# Altium schematic sheet 07 Motion.SchDoc
size A
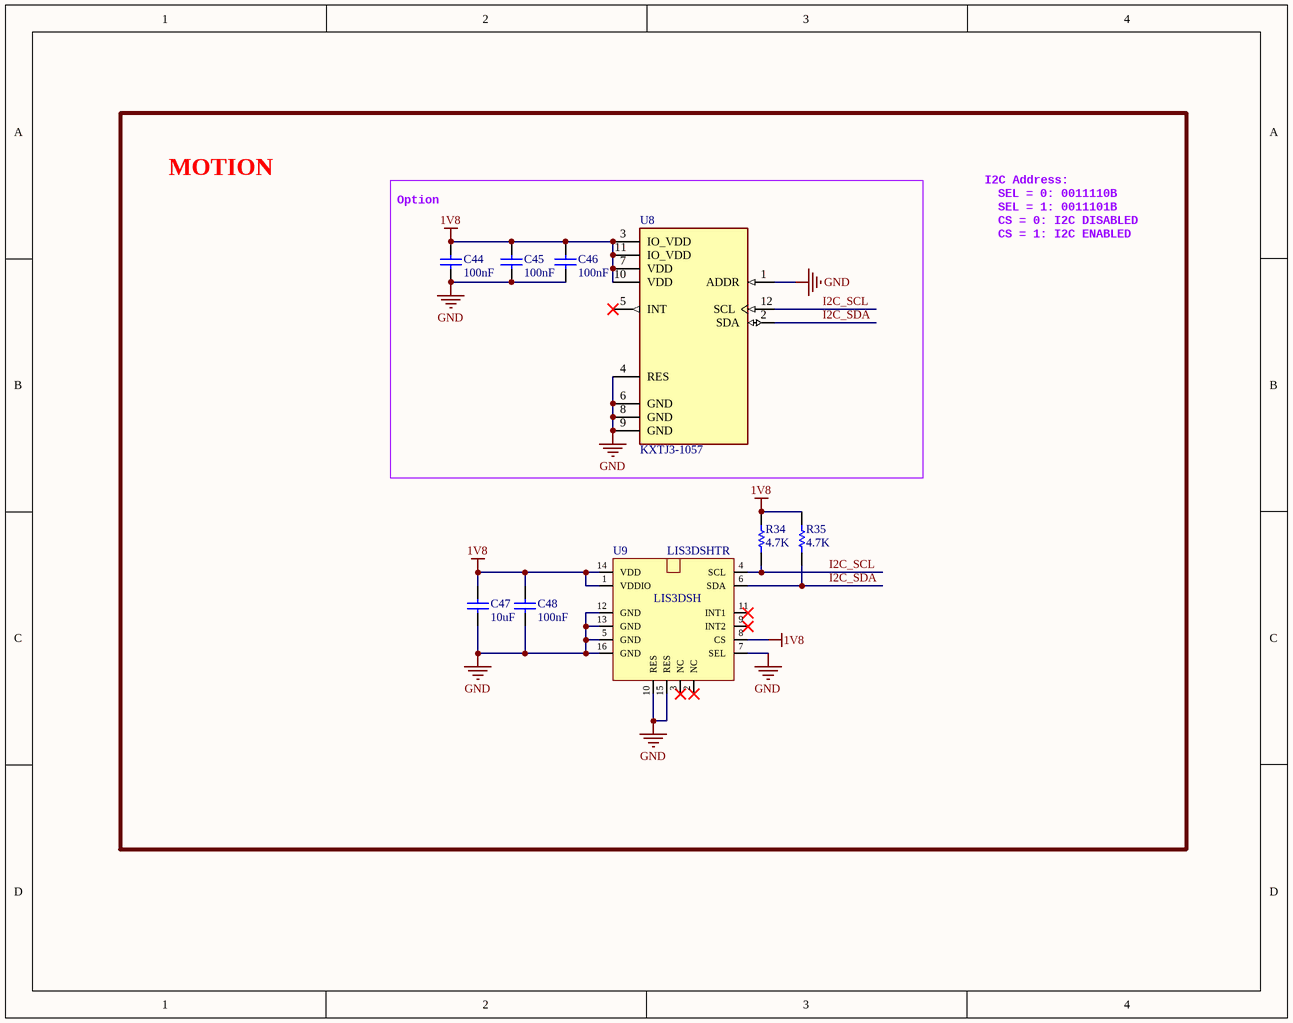
[diagram p0: 07 Motion.SchDoc]

## Parts
C44  100nF  [0603 - C]
C45  100nF  [0603 - C]
C46  100nF  [0603 - C]
C47  10uF  [0603 - C]
C48  100nF  [0603 - C]
R34  4.7K  [0603 - R]
R35  4.7K  [0603 - R]
U8  KXTJ3-1057  [KIONIX_KXTJ3-1057]
U9  LIS3DSHTR  [QFN16P 3x3 - 1]

## Blocks framed on the sheet
MOTION: C47 C48 R34 R35 U9
Option: C44-C46 U8

## Nets
1V8: C44.2 C45.2 C46.2 C47.2 C48.2 R34.2 R35.2 U8.3(IO_VDD) U8.7(VDD) U8.10(VDD) U8.11(IO_VDD) U9.1(VDDIO) U9.8(CS) U9.14(VDD)
GND: C44.1 C45.1 C46.1 C47.1 C48.1 U8.1(ADDR) U8.4(RES) U8.6(GND) U8.8(GND) U8.9(GND) U9.5(GND) U9.7(SEL) U9.10(RES) U9.12(GND) U9.13(GND) U9.15(RES) U9.16(GND)
I2C_SCL: R34.1 U8.12(SCL) U9.4(SCL)
I2C_SDA: R35.1 U8.2(SDA) U9.6(SDA)

Not connected (* = marked no-connect by the designer): U8 5(INT)*; U9 2(NC)* 3(NC)* 9(INT2)* 11(INT1)*

## Notes on the sheet
- I2C Address:
- SEL = 0: 0011110B
- SEL = 1: 0011101B
- CS = 0: I2C DISABLED
- CS = 1: I2C ENABLED
- (in symbol LIS3DSHTR) LIS3DSH

## Library data of the parts
C44-C46 C48 = Cap 0603 100nF: CAP CER 100nF 50V C0G/NP0 0603; MPN: CL10C104JB8NNNC; MFR: SAMSUNG; Company ID: VT_CAP_C0603 100nF; Voltage: 50V; Package: 0603; Size: C0603: 100nF; Value: 100nF
C47 = Cap 0603 10uF: CAP CER 10UF 6.3V X5R 0603; MPN: CC0603KRX5R5BB106; MFR: Yageo; Company ID: VT_CAP_C0603 10uF; Voltage: 6.3V; Size: C0603: 10uF; Package: 0603; Value: 10uF
R34 R35 = Res 0603 4.7K: RES SMD 4.7K OHM 1% 1/10W 0603; MFR: Yageo; MPN: RC0603FR-074K7L; Company ID: VT_RES_R0603 4.7K; Size: R0603: 4.7K; Value: 4.7K
U8 = KXTJ3-1057: ACCELEROMETER 2-16G I2C 12LGA; MFR: Kionix Inc.; Company ID: VT_IC_KXTJ3-1057; Package: LGA-12 Kionix; MPN: KXTJ3-1057
U9 = LIS3DSHTR: ACCEL 2-16G I2C/SPI 16LGA; MFR: ST; Company ID: VT_IC_LIS3DSH; MPN: LIS3DSHTR